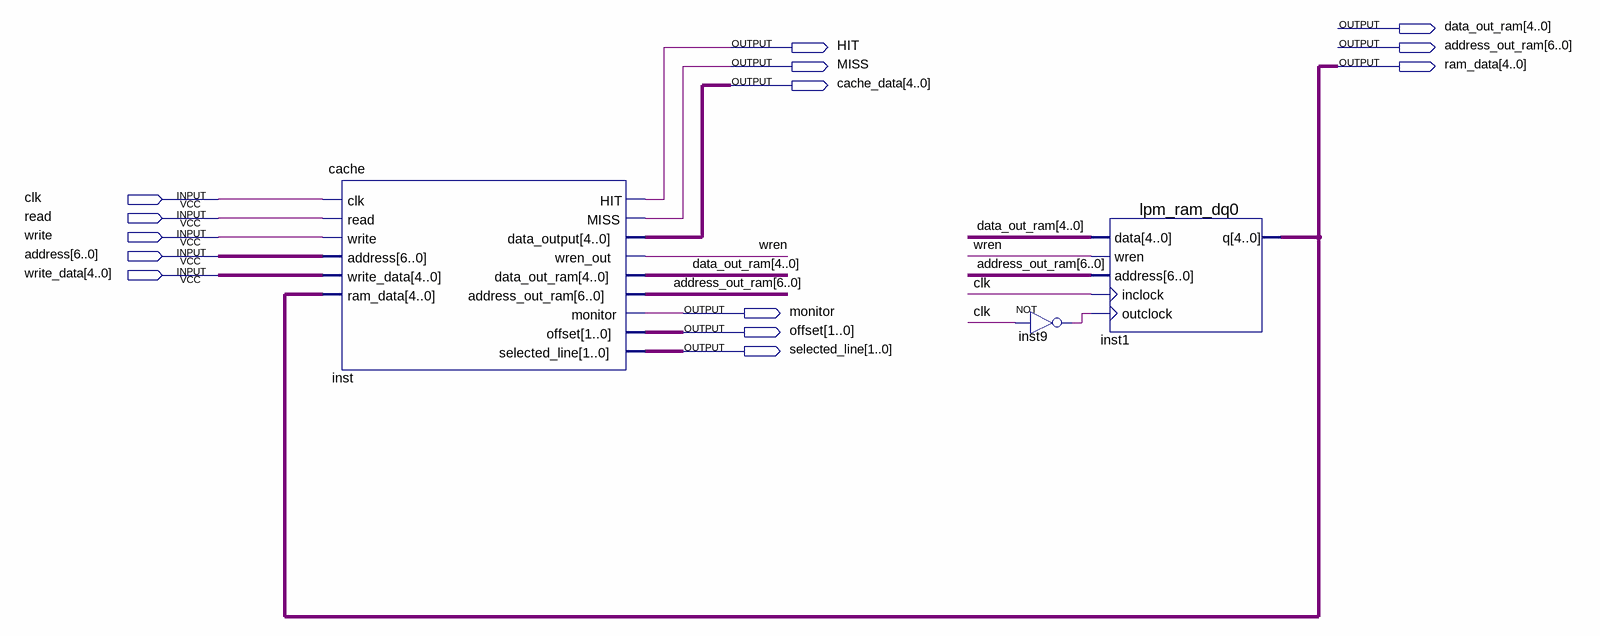
[diagram p0: schematic sheet]
// Quartus schematic main.bdf as structural Verilog: 3 symbols, 14 pins
module main (
  input  clk,
  input  read,
  input  write,
  input  [6:0] address,
  input  [4:0] write_data,
  output [4:0] data_out_ram,
  output HIT,
  output [6:0] address_out_ram,
  output MISS,
  output [4:0] ram_data,
  output [4:0] cache_data,
  output monitor,
  output [1:0] offset,
  output [1:0] selected_line
);

  wire inst9_out, wren;

  cache inst (
    .clk(clk), .read(read), .write(write), .address(address), .write_data(write_data), .ram_data(ram_data),
    .HIT(HIT), .MISS(MISS), .data_output(cache_data), .wren_out(wren), .data_out_ram(data_out_ram),
    .address_out_ram(address_out_ram), .monitor(monitor), .offset(offset), .selected_line(selected_line));
  not inst9 (inst9_out, clk);
  lpm_ram_dq0 inst1 (
    .data(data_out_ram), .wren(wren), .address(address_out_ram), .inclock(clk), .outclock(inst9_out),
    .q(ram_data));
endmodule
